# EAGLE design pycomDaughterBoard (EAGLE 7.5.0)
CNAME: pycom Daughter Board; CREVISION: 0.5; DESIGNER: greg.cope@gmail.com
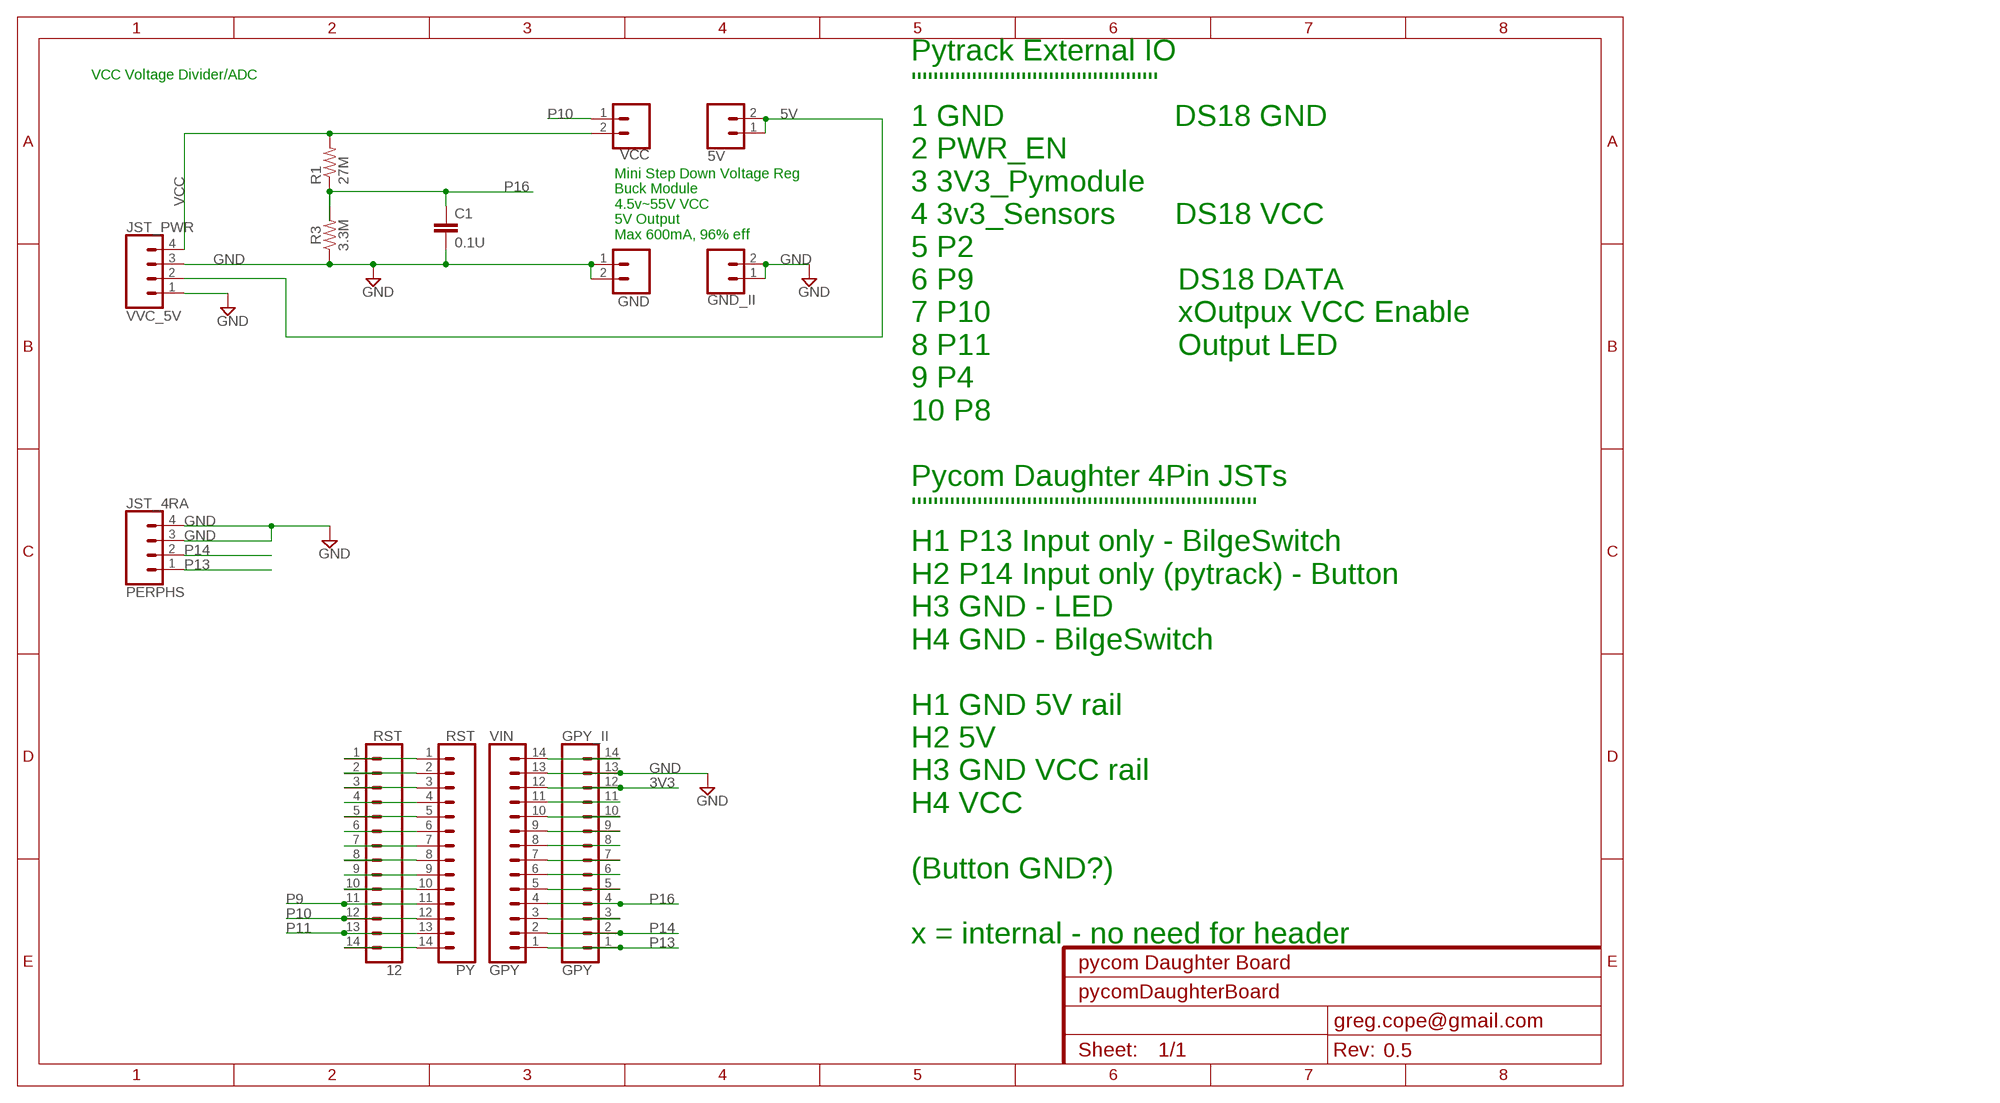
[diagram p0: schematic, sheet 1]

## Parts
5V  5V  CONN_02  [1X02]
12  RST  CONN_14  [1X14]
C1  0.1U  0.1UF-KIT-EZ-50V-20%  [CAP-PTH-SMALL-KIT]
GND  GND  CONN_02  [1X02]
GND_II  GND  CONN_02  [1X02]
GPY_II  GPY  CONN_14  [1X14]
JST_4RA  PERPHS  CONN_04JST-PTH  [JST-4-PTH]
JST_PWR  VVC_5V  CONN_04JST-PTH  [JST-4-PTH]
PY  RST  CONN_14  [1X14]
R1  27M  R-US_0309/12  [0309/12]
R3  3.3M  1KOHM-HORIZ-1/4W-1%  [AXIAL-0.3]
VCC  VCC  CONN_02  [1X02]
VIN  GPY  CONN_14  [1X14]

## Nets
3V3 [power]: GPY_II.12 VIN.12
5V [power]: 5V.1 5V.2 JST_PWR.2
GND [power]: C1.2 GND.1 GND.2 GND_II.1 GND_II.2 GPY_II.13 JST_4RA.3 JST_4RA.4 JST_PWR.1 JST_PWR.3 R3.P$1 VIN.13
N$1 [power]: 12.1 PY.1
N$3 [power]: 12.2 PY.2
N$4 [power]: 12.3 PY.3
N$5 [power]: 12.4 PY.4
N$6 [power]: 12.5 PY.5
N$7 [power]: 12.6 PY.6
N$8 [power]: 12.7 PY.7
N$9 [power]: 12.8 PY.8
N$10 [power]: 12.9 PY.9
N$11 [power]: GPY_II.14 VIN.14
N$12 [power]: GPY_II.9 VIN.9
N$13 [power]: 12.10 PY.10
N$14 [power]: GPY_II.11 VIN.11
N$15 [power]: GPY_II.10 VIN.10
N$16 [power]: 12.14 PY.14
N$17 [power]: GPY_II.8 VIN.8
N$18 [power]: GPY_II.7 VIN.7
N$20 [power]: GPY_II.3 VIN.3
P9 [power]: 12.11 PY.11
P10 [power]: 12.12 PY.12 VCC.1
P11 [power]: 12.13 PY.13
P13 [power]: GPY_II.1 JST_4RA.1 VIN.1
P14 [power]: GPY_II.2 JST_4RA.2 VIN.2
P16 [power]: C1.1 GPY_II.4 R1.1 R3.P$2 VIN.4
P17 [power]: GPY_II.5 VIN.5
P18 [power]: GPY_II.6 VIN.6
VCC [power]: JST_PWR.4 R1.2 VCC.2

## Notes on the sheet
- VCC Voltage Divider/ADC
- Mini Step Down Voltage Reg
  Buck Module
  4.5v~55V VCC
  5V Output
  Max 600mA, 96% eff
- Pytrack External IO
  '''''''''''''''''''''''''''''''''''''''''''''
  1 GND                    DS18 GND
  2 PWR_EN             
  3 3V3_Pymodule  
  4 3v3_Sensors       DS18 VCC
  5 P2
  6 P9                        DS18 DATA
  7 P10                      xOutpux VCC Enable
  8 P11                      Output LED
  9 P4
  10 P8
  
  Pycom Daughter 4Pin JSTs
  '''''''''''''''''''''''''''''''''''''''''''''''''''''''''''''''
  H1 P13 Input only - BilgeSwitch
  H2 P14 Input only (pytrack) - Button
  H3 GND - LED
  H4 GND - BilgeSwitch
  
  H1 GND 5V rail
  H2 5V
  H3 GND VCC rail
  H4 VCC
  
  (Button GND?)
  
  x = internal - no need for header

## Library data of the parts
5V GND GND_II VCC = SparkFun-Connectors:CONN_02: Multi connection point. Often used as Generic Header-pin footprint for 0.1 inch spaced/style header connections On any of the 0.1 inch spaced packages, you can populate with these: Break Away Headers - Straight <https://www.sparkfun.com/products/116> (PRT-00116) Break Away Male Headers - Right Angle <https://www.sparkfun.com/products/553> (PRT-00553) Female Headers <https://www.sparkfun.com/products/115> (PRT-00115) Break Away Headers - Machine Pin <https://www.sparkfun.com/products/117> (PRT-00117) Break Away Female Headers - Swiss Machine Pin <https://www.sparkfun.com/products/743> (PRT-00743) For SCREWTERMINALS and SPRING TERMINALS visit here: Screw Terimnals on SparkFun.com <https://www.sparkfun.com/search/results?term=Screw+Terminals> (5mm/3.5mm/2.54mm spacing) This device is also useful as a general connection point to wire up your design to another part of your project. Our various solder wires solder well into these plated through hole pads. Hook-Up Wire - Assortment (Stranded, 22 AWG) <https://www.sparkfun.com/products/11375> (PRT-11375) Hook-Up Wire - Assortment (Solid Core, 22 AWG) <https://www.sparkfun.com/products/11367> (PRT-11367) View the entire wire category on our website here <https://www.sparkfun.com/categories/141> Special notes: Molex polarized connector foot print use with: PRT-08233 with associated crimp pins and housings. 2.54_SCREWTERM for use with PRT-10571. 3.5mm Screw Terminal footprints for PRT-08084 5mm Screw Terminal footprints for use with PRT-08432
12 GPY_II PY VIN = SparkFun-Connectors:CONN_14: Multi connection point. Often used as Generic Header-pin footprint for 0.1 inch spaced/style header connections On any of the 0.1 inch spaced packages, you can populate with these: Break Away Headers - Straight <https://www.sparkfun.com/products/116> (PRT-00116) Break Away Male Headers - Right Angle <https://www.sparkfun.com/products/553> (PRT-00553) Female Headers <https://www.sparkfun.com/products/115> (PRT-00115) Break Away Headers - Machine Pin <https://www.sparkfun.com/products/117> (PRT-00117) Break Away Female Headers - Swiss Machine Pin <https://www.sparkfun.com/products/743> (PRT-00743) For SCREWTERMINALS and SPRING TERMINALS visit here: Screw Terimnals on SparkFun.com <https://www.sparkfun.com/search/results?term=Screw+Terminals> (5mm/3.5mm/2.54mm spacing) This device is also useful as a general connection point to wire up your design to another part of your project. Our various solder wires solder well into these plated through hole pads. Hook-Up Wire - Assortment (Stranded, 22 AWG) <https://www.sparkfun.com/products/11375> (PRT-11375) Hook-Up Wire - Assortment (Solid Core, 22 AWG) <https://www.sparkfun.com/products/11367> (PRT-11367) View the entire wire category on our website here <https://www.sparkfun.com/categories/141> Special notes: Molex polarized connector foot print use with SKU : PRT-08231 with associated crimp pins and housings. 1MM SMD Version SKU: PRT-10208 NOTES ON THE VARIANTS LOCK and LOCK_LONGPADS... This footprint was designed to help hold the alignment of a through-hole component (i.e. 6-pin header) while soldering it into place. You may notice that each hole has been shifted either up or down by 0.005 of an inch from it's more standard position (which is a perfectly straight line). This slight alteration caused the pins (the squares in the middle) to touch the edges of the holes. Because they are alternating, it causes a "brace" to hold the component in place. 0.005 has proven to be the perfect amount of "off-center" position when using our standard breakaway headers. Although looks a little odd when you look at the bare footprint, once you have a header in there, the alteration is very hard to notice. Also,if you push a header all the way into place, it is covered up entirely on the bottom side.
C1 = SparkFun-Capacitors:0.1UF: 0.1µF ceramic capacitors A capacitor is a passive two-terminal electrical component used to store electrical energy temporarily in an electric field.; PROD_ID: CAP-08370; VALUE: 0.1uF
JST_4RA JST_PWR = SparkFun-Connectors:CONN_04: Multi connection point. Often used as Generic Header-pin footprint for 0.1 inch spaced/style header connections On any of the 0.1 inch spaced packages, you can populate with these: Break Away Headers - Straight <https://www.sparkfun.com/products/116> (PRT-00116) Break Away Male Headers - Right Angle <https://www.sparkfun.com/products/553> (PRT-00553) Female Headers <https://www.sparkfun.com/products/115> (PRT-00115) Break Away Headers - Machine Pin <https://www.sparkfun.com/products/117> (PRT-00117) Break Away Female Headers - Swiss Machine Pin <https://www.sparkfun.com/products/743> (PRT-00743) For SCREWTERMINALS and SPRING TERMINALS visit here: Screw Terimnals on SparkFun.com <https://www.sparkfun.com/search/results?term=Screw+Terminals> (5mm/3.5mm/2.54mm spacing) This device is also useful as a general connection point to wire up your design to another part of your project. Our various solder wires solder well into these plated through hole pads. Hook-Up Wire - Assortment (Stranded, 22 AWG) <https://www.sparkfun.com/products/11375> (PRT-11375) Hook-Up Wire - Assortment (Solid Core, 22 AWG) <https://www.sparkfun.com/products/11367> (PRT-11367) View the entire wire category on our website here <https://www.sparkfun.com/categories/141> Special notes: Molex polarized connector foot print use with SKU : PRT-08231 with associated crimp pins and housings. 1MM SMD Version SKU: PRT-10208; PROD_ID: WIRE-13531; SF_ID: PRT-09916
R1 = adafruit:R-US_: RESISTOR, American symbol
R3 = SparkFun-Resistors:1KOHM: 1kΩ resistor A resistor is a passive two-terminal electrical component that implements electrical resistance as a circuit element. Resistors act to reduce current flow, and, at the same time, act to lower voltage levels within circuits. - Wikipedia; PROD_ID: RES-12182; VALUE: 1k

## Net classes
0 default: width 0.254 mm, clearance 0.254 mm
1 power: width 0.61 mm, clearance 0.254 mm

## Board
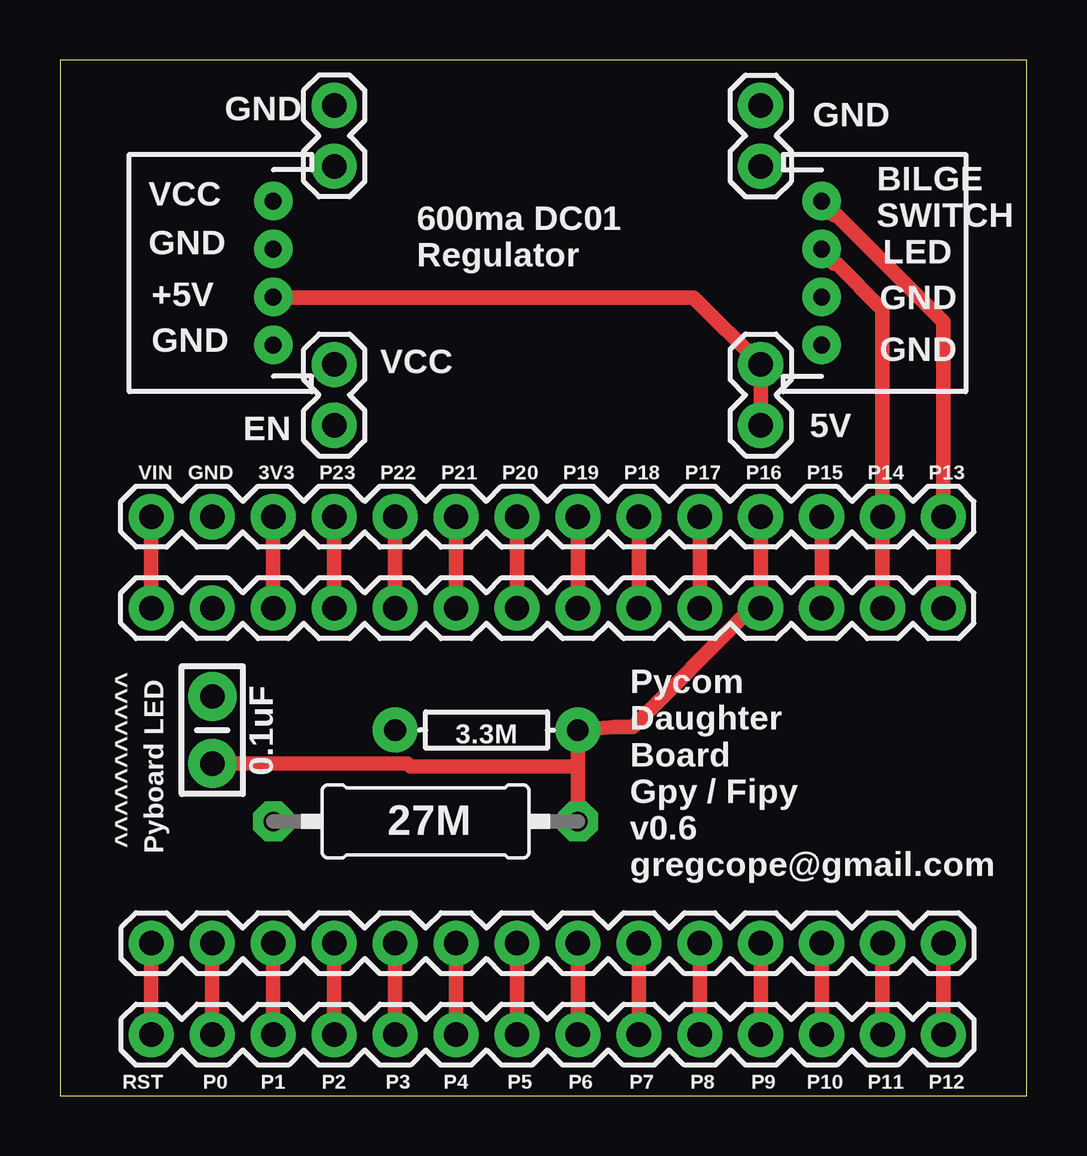
[diagram p1: board, top side]
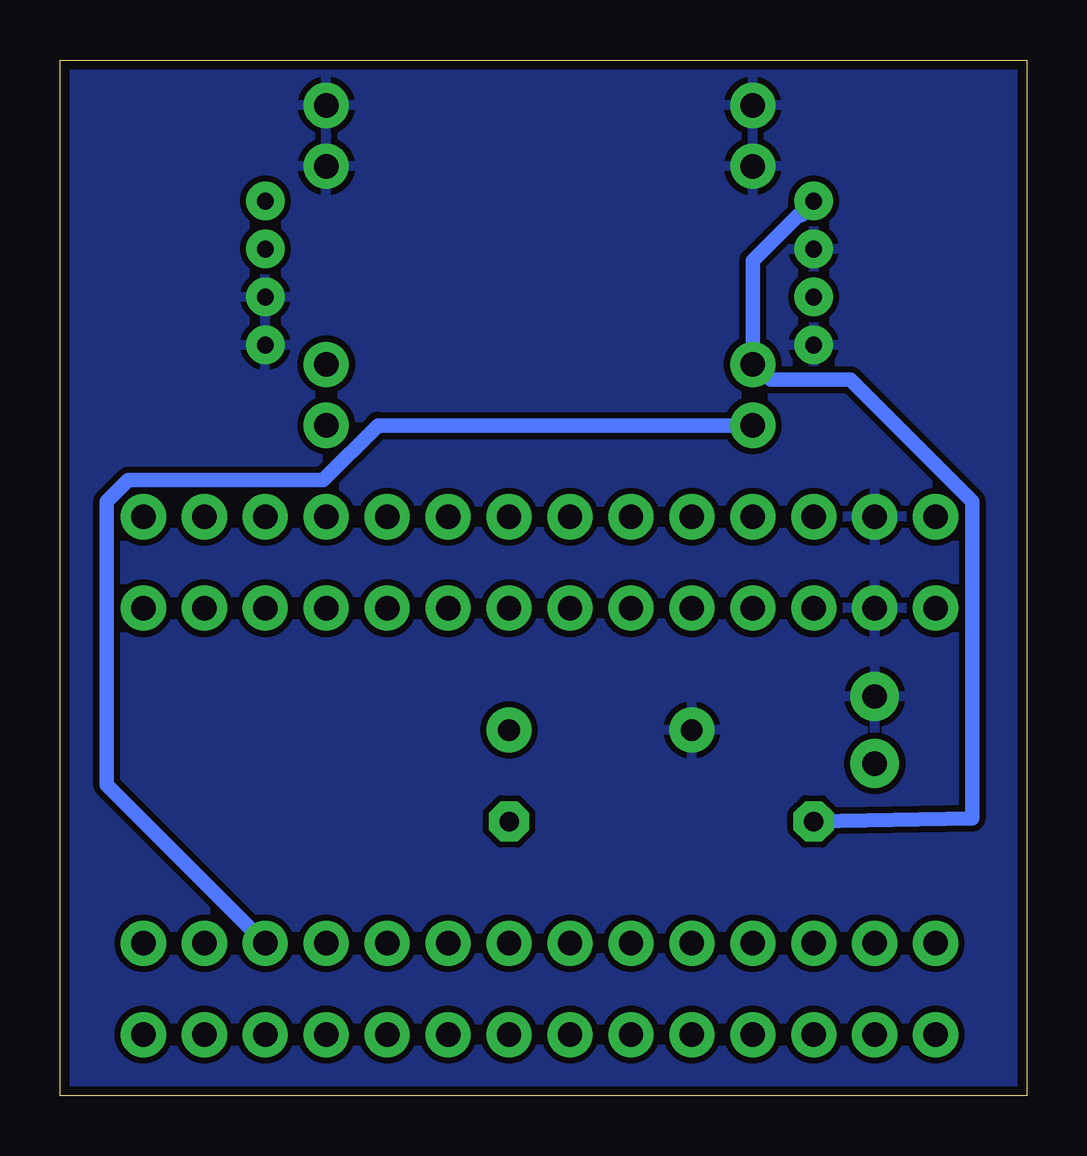
[diagram p2: board, bottom side, seen from below]

Size 40.31 x 43.17 mm. Coordinates in mm from the lower left corner, seen from the top.
Outline: 0,0 40.31,0 40.31,43.17 0,43.17 0,0
Copper layers (1*16): Top 0.0356mm / dielectric 1.5011mm / Bottom 0.0356mm
Design rules "oshpark-2layer": minimum track width 6mil, minimum drill 13mil, track to track 6mil, track to pad 6mil, pad to pad 6mil, via to via 6mil, smd to smd 6mil, copper to edge 15mil, drill to drill 6mil, minimum pad ring 7mil, minimum via ring 7mil, stop-mask expansion 2.5mil, vias tented up to drill 0mil, thermal gap 10mil

### Footprints (pad centres in the part's own frame; a part is rotated, then mirrored left to right if it is on the bottom)
1X02 = drill 1.016 pad 1.88: 1 0,0; 2 2.54,0
1X14 = drill 1.016 pad 1.88: 1 0,0; 2 2.54,0; 3 5.08,0; 4 7.62,0; 5 10.16,0; 6 12.7,0; 7 15.24,0; 8 17.78,0; 9 20.32,0; 10 22.86,0; 11 25.4,0; 12 27.94,0; 13 30.48,0; 14 33.02,0
CAP-PTH-SMALL-KIT = drill 1.016 pad 2.032: 1 -1.397,0; 2 1.397,0
JST-4-PTH = drill 0.7 pad 1.6: 1 -3,0; 2 -1,0; 3 1,0; 4 3,0
0309/12 = drill 0.813 pad 1.676 octagon: 1 -6.35,0; 2 6.35,0
AXIAL-0.3 = drill 0.9 pad 1.88: P$1 -3.81,0; P$2 3.81,0

### Placement (x,y rotation side)
5V  29.21,27.94 90 top
12  3.81,6.35 0 top
C1  6.35,15.24 90 top
GND  29.21,38.73 90 top
GND_II  11.43,41.27 270 top
GPY_II  36.83,20.32 180 top
JST_4RA  31.75,34.29 270 top
JST_PWR  8.89,34.29 90 top
PY  3.81,2.54 0 top
R1  15.24,11.43 180 top
R3  17.78,15.24 0 top
VCC  11.43,27.94 90 top
VIN  36.83,24.13 180 top

### Tracks (layer width: path | path; a pad name or v marks a point on that pad's centre or on a via)
3V3
  Top 0.61: VIN.12 GPY_II.12
5V
  Top 0.61: JST_PWR.2 8.89,33.27 26.42,33.27 5V.2 5V.1
GND
  pour Bottom (isolate 0.012): 0,43.18 40.64,43.18 40.64,0 0,0
N$1
  Top 0.61: 12.1 PY.1
N$3
  Top 0.61: 12.2 PY.2
N$4
  Top 0.61: 12.3 PY.3
N$5
  Top 0.61: 12.4 PY.4
N$6
  Top 0.61: 12.5 PY.5
N$7
  Top 0.61: 12.6 PY.6
N$8
  Top 0.61: 12.7 PY.7
N$9
  Top 0.61: 12.8 PY.8
N$10
  Top 0.61: 12.9 PY.9
N$11
  Top 0.61: VIN.14 GPY_II.14
N$12
  Top 0.61: VIN.9 GPY_II.9
N$13
  Top 0.61: 12.10 PY.10
N$14
  Top 0.61: VIN.11 GPY_II.11
N$15
  Top 0.61: VIN.10 GPY_II.10
N$16
  Top 0.61: 12.14 PY.14
N$17
  Top 0.61: VIN.8 GPY_II.8
N$18
  Top 0.61: VIN.7 GPY_II.7
N$20
  Top 0.61: VIN.3 GPY_II.3
P9
  Top 0.61: 12.11 PY.11
P10
  Top 0.61: 12.12 PY.12
  Bottom 0.61: VCC.1 27.05,27.94 29.34,25.65 37.47,25.65 38.35,24.77 38.35,12.95 12.12
P11
  Top 0.61: 12.13 PY.13
P13
  Top 0.61: JST_4RA.1 31.75,37.21 32.26,36.7 32.38,36.7 36.83,32.26 VIN.1 GPY_II.1
P14
  Top 0.61: JST_4RA.2 31.75,35.18 32.26,34.67 32.38,34.67 34.29,32.77 VIN.2 GPY_II.2
P16
  Top 0.61: VIN.4 GPY_II.4 28.96,20.19 28.7,20.19 23.88,15.37 23.11,15.37 R3.P$2 21.59,13.72 | 21.59,13.72 R1.1 | C1.1 14.48,13.84 14.61,13.72 21.59,13.72
P17
  Top 0.61: VIN.5 GPY_II.5
P18
  Top 0.61: VIN.6 GPY_II.6
VCC
  Bottom 0.61: JST_PWR.4 8.89,37.21 9.4,36.7 9.53,36.7 11.43,34.8 VCC.2 11.18,30.35 10.67,29.84 7.37,29.84 2.29,24.77 2.29,11.56 R1.2

### Text on the board
tNames: VCC | BILGE / SWITCH | GND | 600ma DC01 / Regulator | LED | +5V | GND | GND | GND | EN | VIN | GND | 3V3 | P23 | P22 | P21 | P20 | P19 | P18 | P17 | P16 | P15 | P14 | P13 | ^^^^^^^^^^^ / Pyboard LED | 0.1uF | Pycom / Daughter / Board / Gpy / Fipy / v0.6 / gregcope@gmail.com | RST | P0 | P1 | P2 | P3 | P4 | P5 | P6 | P7 | P8 | P9 | P10 | P11 | P12